# EAGLE design mMicroSD (EAGLE 6.2)
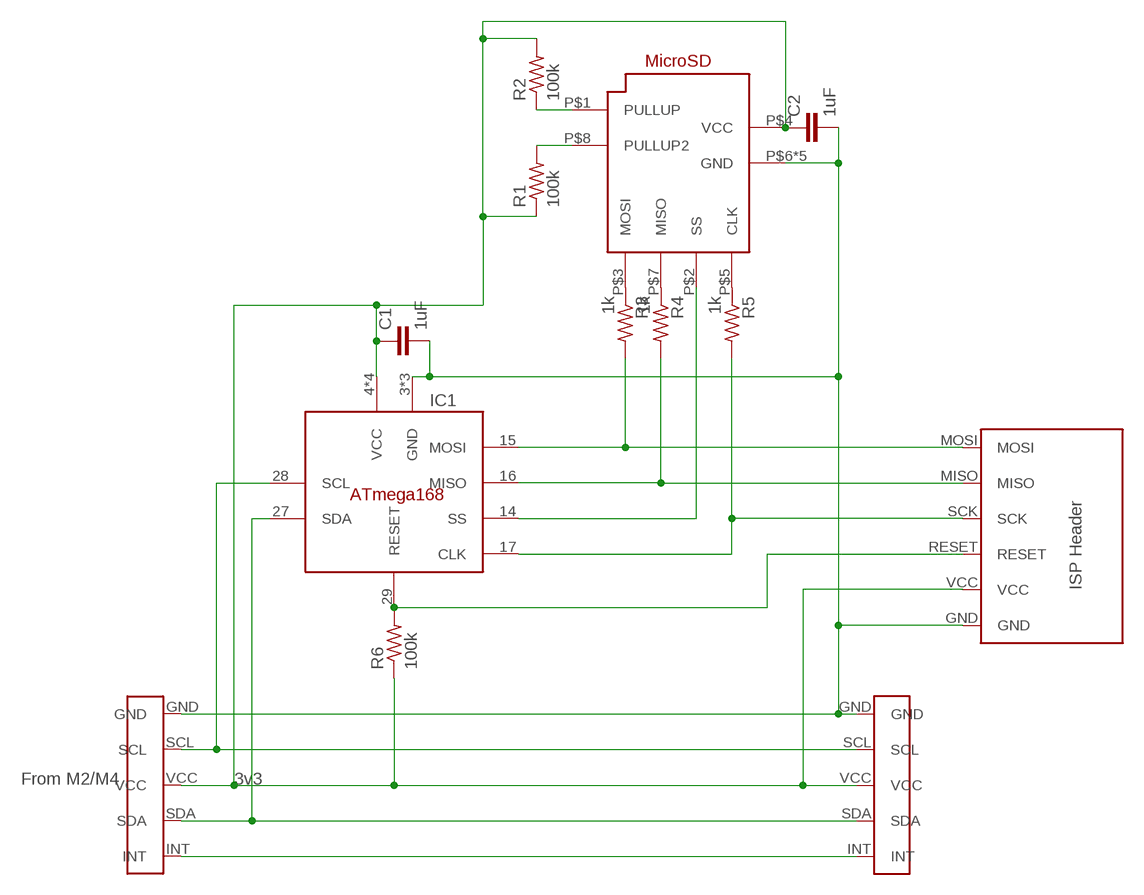
[diagram p0: schematic, sheet 1]

## Parts
C1  1uF  C-EUC0805  [C0805]
C2  1uF  C-EUC0805  [C0805]
IC1  ATMEGA168  [ATMEGA168]
R1  100k  R-US_R2012  [R2012]
R2  100k  R-US_R2012  [R2012]
R3  1k  R-US_R2012  [R2012]
R4  1k  R-US_R2012  [R2012]
R5  1k  R-US_R2012  [R2012]
R6  100k  R-US_R2012  [R2012]
SDCONN  101-00660-68-6  [101-00660-68-6]
U$1  MBUS_OUT  [MBUS_OUT]
U$2  MBUS_IN  [MBUS_IN]
U$3  ISP  [ISP]

## Nets
GND: C1.2 C2.2 IC1.3(GND) IC1.5(GND) IC1.21(GND) SDCONN.P$6(GND) SDCONN.P$9(GND) SDCONN.P$10(GND) SDCONN.P$11(GND) SDCONN.P$12(GND) U$1.GND U$2.GND U$3.GND
N$1: U$1.INT U$2.INT
N$2: IC1.27(SDA) U$1.SDA U$2.SDA
N$3: IC1.28(SCL) U$1.SCL U$2.SCL
N$4: IC1.14(SS) SDCONN.P$2(SS)
N$5: R3.1 SDCONN.P$3(MOSI)
N$6: R4.1 SDCONN.P$7(MISO)
N$7: IC1.16(MISO) R4.2 U$3.MISO
N$8: IC1.15(MOSI) R3.2 U$3.MOSI
N$9: IC1.29(RESET) R6.2 U$3.RESET
N$12: R1.2 SDCONN.P$8(PULLUP2)
N$13: R2.1 SDCONN.P$1(PULLUP)
N$14: IC1.17(CLK) R5.2 U$3.SCK
N$15: R5.1 SDCONN.P$5(CLK)
VCC: C1.1 C2.1 IC1.4(VCC) IC1.6(VCC) IC1.18(VCC) IC1.20(VCC) R1.1 R2.2 R6.1 SDCONN.P$4(VCC) U$1.VCC U$2.VCC U$3.VCC

## Notes on the sheet
- From M2/M4 | 3v3

## Library data of the parts
C1 C2 = resistor:C-EU: CAPACITOR, European symbol
IC1 = zz-kent:ATMEGA168: 32-TQFP package
R1-R6 = rcl:R-US_: RESISTOR, American symbol
SDCONN = zz-kent:101-00660-68-6: MicroSD connector
U$1 = zz-kent:MBUS_OUT
U$2 = zz-kent:MBUS_IN
U$3 = zz-kent:ISP: ISP header

## Board
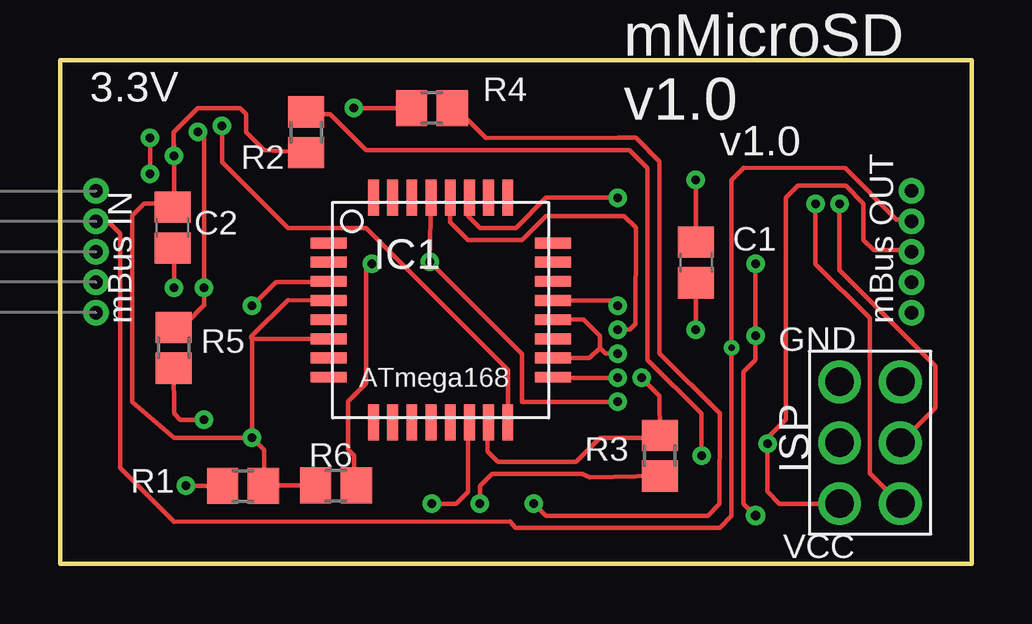
[diagram p1: board, top side]
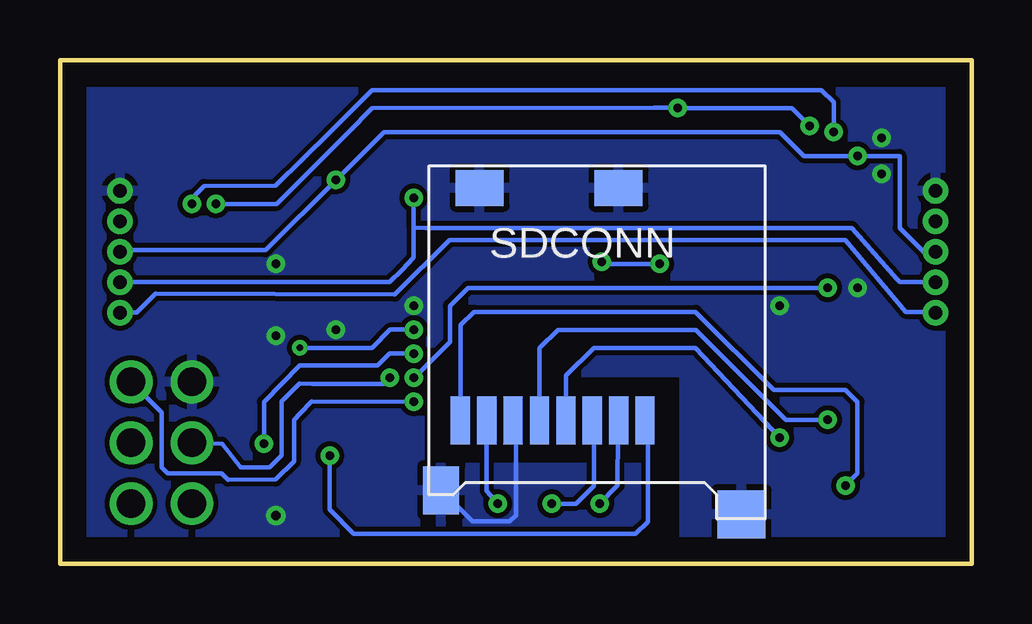
[diagram p2: board, bottom side, seen from below]

Size 38 x 21 mm. Coordinates in mm from the lower left corner, seen from the top.
Outline: 0,0 38,0 38,21 0,21 0,0
Copper layers (1*16): Top 0.035mm / dielectric 1.5mm / Bottom 0.035mm
Design rules: minimum track width 6mil, minimum drill 10mil, track to track 8mil, track to pad 8mil, pad to pad 8mil, via to via 8mil, smd to smd 8mil, copper to edge 40mil, drill to drill 7mil, minimum pad ring 10mil, minimum via ring 8mil, stop-mask expansion 4mil, vias tented up to drill 0mil, thermal gap 10mil

### Footprints (pad centres in the part's own frame; a part is rotated, then mirrored left to right if it is on the bottom)
C0805 = smd 1.3 x 1.5: 1 -0.85,0; 2 0.85,0
ATMEGA168 = smd 1.5 x 0.45: 1 -4.572,2.91; 2 -4.572,2.11; 3 -4.572,1.31; 4 -4.572,0.51; 5 -4.572,-0.29; 6 -4.572,-1.09; 7 -4.572,-1.89; 8 -4.572,-2.69; 17 4.793,-2.69; 18 4.793,-1.89; 19 4.793,-1.09; 20 4.793,-0.29; 21 4.793,0.51; 22 4.793,1.31; 23 4.793,2.11; 24 4.793,2.91 | smd 0.45 x 1.5: 9 -2.69,-4.572; 10 -1.89,-4.572; 11 -1.09,-4.572; 12 -0.29,-4.572; 13 0.51,-4.572; 14 1.31,-4.572; 15 2.11,-4.572; 16 2.91,-4.572; 25 2.91,4.793; 26 2.11,4.793; 27 1.31,4.793; 28 0.51,4.793; 29 -0.29,4.793; 30 -1.09,4.793; 31 -1.89,4.793; 32 -2.69,4.793
R2012 = smd 1.3 x 1.5: 1 -0.85,0; 2 0.85,0
101-00660-68-6 = smd 2 x 0.8: P$1 4.9,1; P$2 4.9,-0.1; P$3 4.9,-1.2; P$4 4.9,-2.3; P$5 4.9,-3.4; P$6 4.9,-4.5; P$7 4.9,-5.6; P$8 4.9,-6.7 | smd 1.5 x 2: P$9 -4.8,-0.1; P$10 -4.8,-5.9 | smd 2 x 1.5: P$11 7.8,-7.5 | smd 2 x 2.008: P$12 8.8,5.018
MBUS_OUT = drill 0.559 pad 0.762: GND 0,2.54; INT 0,-2.54; SCL 0,1.27; SDA 0,-1.27; VCC 0,0
MBUS_IN = drill 0.559 pad 0.762: GND 0,2.54; INT 0,-2.54; SCL 0,1.27; SDA 0,-1.27; VCC 0,0
ISP = drill 1.194: GND 5.08,0; MISO 0,-2.54; MOSI 2.54,0; RESET 5.08,-2.54; SCK 2.54,-2.54; VCC 0,0

### Placement (x,y rotation side)
C1  26.52,12.56 270 top
C2  4.69,14.01 270 top
IC1  15.76,10.46 0 top
R1  7.63,3.23 180 top
R2  10.27,17.98 270 top
R3  25,4.5 90 top
R4  15.5,19 180 top
R5  4.75,9 90 top
R6  11.5,3.25 0 top
SDCONN  14.61,10.86 270 bottom
U$1  35.5,13 0 top
U$2  1.5,13 0 top
U$3  32.5,2.5 90 top

### Tracks (layer width: path | path; a pad name or v marks a point on that pad's centre or on a via)
GND  (via drill 0.36, 0.41)
  Top 0.178: v4.75,11.5 4.75,13.1 C2.2 | v8,10.75 9,11.75 10.85,11.75 IC1.3 | v26.5,9.75 26.5,11.69 C1.2 | IC1.21 22.97,10.97 23.19,10.75 v23.25,10.75 | v29,12.5 v29,9.5 29,8.5 28.5,8 28.5,2.5 v29,2 | v3.75,17.75 v3.75,16.25
  Bottom 0.178: SDCONN.P$6 19,5.96 19,2 19.25,1.75 20.8,1.75 SDCONN.P$11
  pour Bottom: 0,0 0,21 38,21 38,0 13.5,0 13.5,4 23,4 23,8 12,8 12,0
N$1
  Bottom 0.178: U$2.INT 1.54,10.5 2.5,10.5 2.75,10.5 5.25,13.5 21.75,13.5 24.04,11.21 34,11.25 34.79,10.46 U$1.INT
N$2  (via drill 0.36)
  Top 0.178: IC1.27 17,15.64 17,14.5 17.5,14 19,14 20.25,15.25 v23.25,15.25
  Bottom 0.178: U$2.SDA 2.98,11.73 3.12,11.88 5,14 22.75,14 23.25,14 v23.25,15.25 23.25,12.75 23.75,12.25 24.27,11.73 U$1.SDA
N$3  (via drill 0.25, 0.36)
  Top 0.178: 28,6.5 28,5 28,2 27.5,1.5 19,1.5 18.75,1.75 4.75,1.75 2.5,4 2.5,13.75 2,14.25 1.52,14.25 U$2.SCL | IC1.28 16.21,15.54 16.25,14.25 17,13.5 19.25,13.5 20.25,14.5 23.5,14.5 24,14 24,10 23.75,9.75 v23.25,9.75 | 28,6.5 28,7 v28,9 28,16 28.5,16.5 32.73,16.48 34.88,14.34 35.44,14.34 U$1.SCL | 28,6.5
  Bottom 0.178: v23.25,9.75 24.25,9.75 25,9 v28,9
N$4  (via drill 0.36)
  Top 0.178: IC1.14 17.02,6.26 17,3 16.5,2.5 v15.5,2.5
  Bottom 0.178: v15.5,2.5 14.75,3.25 14.75,5.42 | 14.75,5.75 14.75,5.42 | 14.75,5.42 SDCONN.P$2
N$5  (via drill 0.36)
  Top 0.178: R3.1 22.1,3.6 21.75,3.75 18,3.75 17.5,3.25 v17.5,2.5
  Bottom 0.178: v17.5,2.5 16.5,2.5 15.75,3.25 15.75,6.4 SDCONN.P$3
N$6  (via drill 0.36)
  Top 0.178: v19.75,2.5 20.25,2 27,2 27.5,2.5 27.5,6.25 25,8.75 25,16.75 24,17.75 23.25,17.75 17.75,17.75 16.5,19 R4.1
  Bottom 0.178: SDCONN.P$7 20.25,5.75 20.21,4.71 20.21,3.04 v19.75,2.5
N$7  (via drill 0.36)
  Top 0.178: v12.25,19 13.25,19 13.5,19 R4.2 | v6.75,18.25 6.75,16.75 9.5,14 12.75,14 18.67,8.08 IC1.16 | U$3.MISO 35,2.5 33.75,3.75 33.75,10.25 31.5,12.5 v31.5,15
  Bottom 0.178: v6.75,18.25 7.5,19 12,19 | 12,19 | 12,19 v12.25,19 13.25,19 25,19 25.96,18 28.96,15 v31.5,15
N$8  (via drill 0.36)
  Top 0.178: v24.25,7.75 25,7 R3.2 24.9,5.25 22.5,5.25 21.5,4.25 18.25,4.25 17.82,4.68 17.82,6.18 IC1.15 18,5.44
  Bottom 0.178: v24.25,7.75 24.5,7.5 27.5,7.5 28,7.5 28.75,6.75 28.75,4.5 29,4.25 29.25,4 29.75,4 30.46,4 31.21,4.96 31.25,5 U$3.MOSI | v24.25,7.75
N$9  (via drill 0.36)
  Top 0.178: v23.25,6.75 19.25,6.75 19.25,8.75 15.5,12.5 v15.41,12.59 IC1.29 | R6.2 12.25,3.25 12.25,4.5 12,4.75 12,6.75 12.75,7.5 12.75,12.25 v13,12.5
  Bottom 0.178: v23.25,6.75 27.5,6.75 28,6.25 28.25,6 28.25,4.25 29,3.5 31,3.5 31.25,3.75 33.5,3.75 33.75,4 33.75,6.29 U$3.RESET | v13,12.5 15.33,12.5 v15.41,12.59
N$12  (via drill 0.36)
  Top 0.178: v5.25,3.25 5.23,3.23 R1.2
  Bottom 0.178: v5.25,3.25 | v5.25,3.25 4.75,3.75 4.75,6.75 5.25,7.25 8.25,7.25 11.5,10.5 20.75,10.5 21.31,9.94 SDCONN.P$8
N$13  (via drill 0.36)
  Top 0.178: v26.75,4.5 26.75,6.25 24.5,8.5 24.5,16.5 23.75,17.25 12.75,17.25 11.25,18.75 11.06,18.75 R2.1
  Bottom 0.178: SDCONN.P$1 13.46,5.46 13.5,4.5 13.5,1.75 14,1.25 20,1.25 21,1.25 25.75,1.25 26.75,2.25 v26.75,4.5
N$14  (via drill 0.36)
  Top 0.178: v23.25,7.75 21.39,7.75 IC1.17 | v5.75,18 6,17.75 v6,11.5 6,10.75 | 6,10.75 5.25,10 R5.2 | 6,10.75 | U$3.SCK | U$3.SCK 36.5,6.5 36.5,8.25 32.5,12.25 v32.5,15
  Bottom 0.178: v6,11.5 11.5,11.5 13,11.5 21,11.5 21.75,10.75 21.75,9.25 v23.25,7.75 | v5.75,18 5.75,19.25 6.25,19.75 25,19.75 26.75,18 29,15.75 32,15.75 32.5,15.25 v32.5,15
N$15  (via drill 0.36)
  Top 0.178: R5.1 4.75,6.25 5,6 v6,6
  Bottom 0.178: SDCONN.P$5 18.01,8.99 17.25,9.75 11.5,9.75 7.75,6 v6,6
VCC  (via drill 0.36)
  Top 0.178: R2.2 8.5,17.25 7.75,18 7.75,18.75 7.5,19 5.75,19 4.74,17.99 | IC1.6 8,9.37 | IC1.4 9.5,11 7.97,9.47 7.97,9.4 8,9.37 | IC1.18 22.07,8.57 22.5,9 | v8,5.25 8.5,4.75 R1.1 8.48,3.25 R6.1 | v8,5.25 8,9.37 | IC1.20 21.83,10.17 22.5,9.5 22.5,9 | v8,5.25 4.75,5.25 3,6.75 3,14.5 3.5,15 4.55,15 C2.1 4.76,14.93 4.76,15.93 4.74,17.99 | 30.25,6 29.5,5.25 v29.5,5 29.5,3 30,2.5 U$3.VCC | v23.25,8.75 | C1.1 26.52,16 v26.5,16 | 4.74,17.99 v4.75,17 | v26.5,16 | U$3.VCC | 30.25,6 30.25,15.25 30.75,15.75 32.75,15.75 33.5,15 33.5,13.5 33.94,13.06 35.44,13.06 U$1.VCC | 30.25,6 | v23.25,8.75 22.75,8.75 22.5,9
  Bottom 0.178: v23.25,8.75 24.25,8.75 24.75,8.25 28,8.25 29.5,6.75 v29.5,5 | SDCONN.P$4 16.91,7.84 15.75,9 11.5,9 v8,5.25 | v26.5,16 29.43,13.06 35.44,13.06 U$1.VCC | U$2.VCC 2,13 2.15,13.14 3,14 3,17 v4.75,17 v4.76,16.99 v4.76,17 7,17 8,18 24.5,18 v26.5,16 | v26.5,16

### Text on the board
tNames: 3.3V | mMicroSD / v1.0 | v1.0 | mBus IN | mBus OUT